# Altium schematic sheet Power.SchDoc
size A4; SheetNumber: 4; SheetTotal: 4
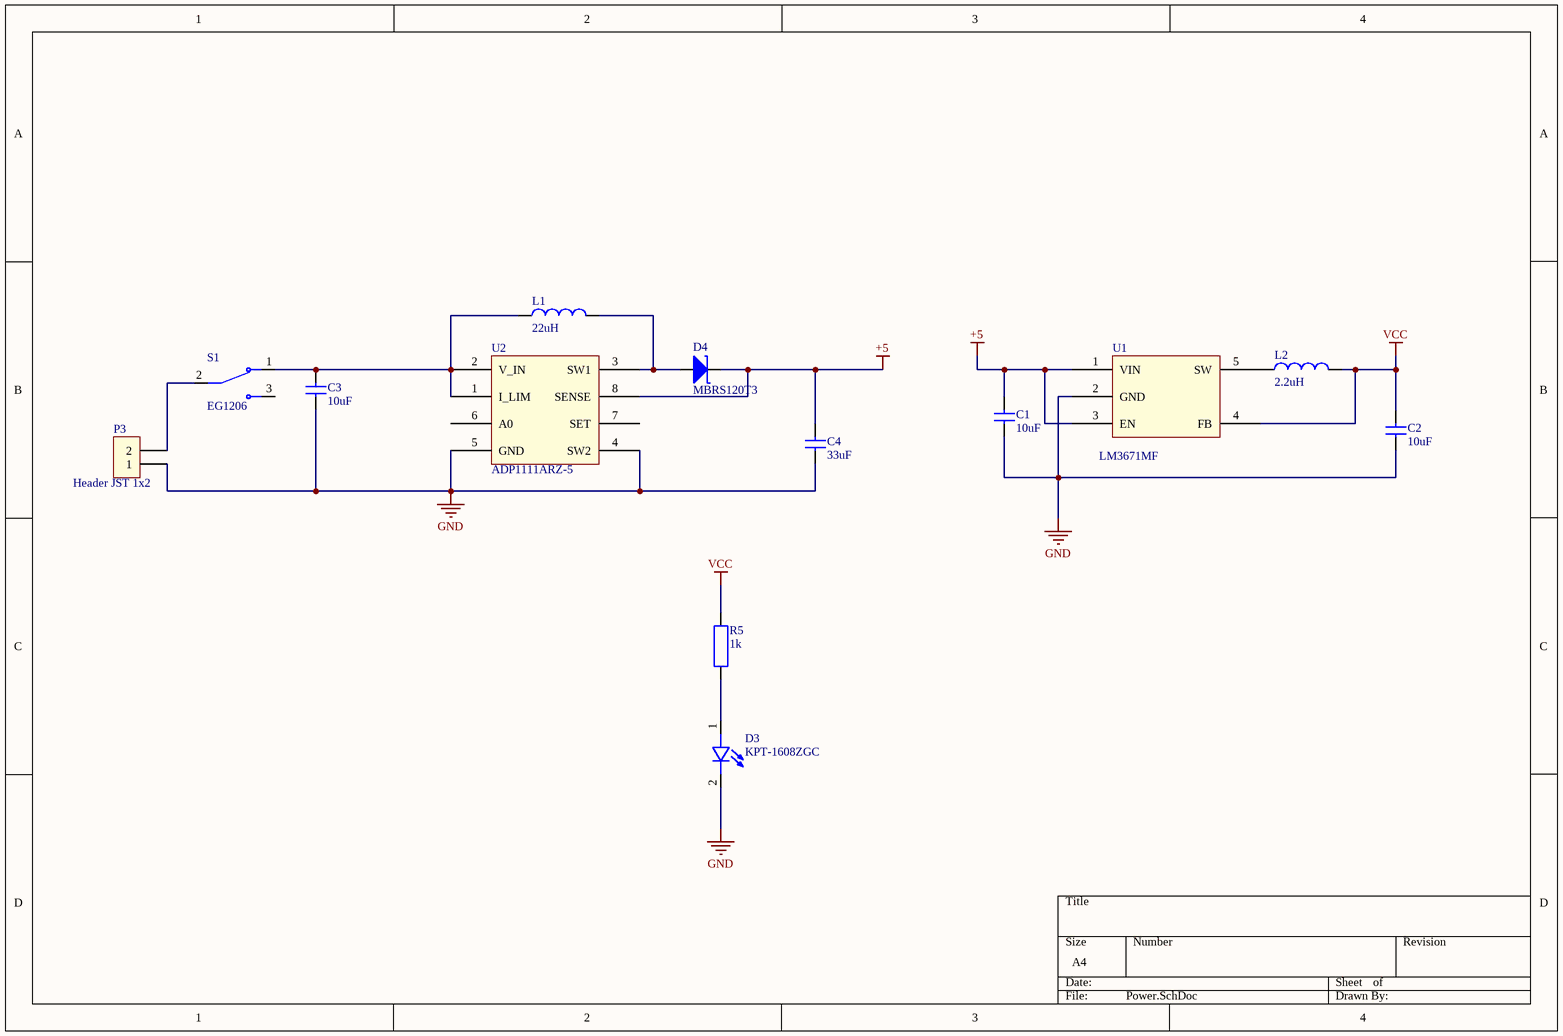
[diagram p0: Power.SchDoc]

## Parts
C1  10uF  [SMD_CAPACITOR_1206]
C2  10uF  [SMD_CAPACITOR_1206]
C3  value 10uF  [SMD_CAPACITOR_1206]  (hidden comment: 100nF)
C4  value 33uF  [SMD_CAPACITOR_1206]  (hidden comment: 100nF)
D3  KPT-1608ZGC  [LED_KPT-1608ZGC]
D4  MBRS120T3  [SMD_DO-214AC]
L1  22uH  [SMD_INDUCTOR_7.3MM]
L2  value 2.2uH  [SMD_INDUCTOR_0805]  (hidden comment: 22uH)
P3  Header JST 1x2  [THT_HEADER_78MIL_JST_1X2_MALE]
R5  1k  [SMD_RESISTOR_1206]
S1  EG1206  [SW_EG1206]
U1  LM3671MF  [SMD_SOT-23-5]
U2  ADP1111ARZ-5  [SMD_SOIC-8]

## Nets
+5: C1.2 C4.2 D4.2 U1.1(VIN) U1.3(EN) U2.8(SENSE)
GND: C1.1 C2.2 C3.2 C4.1 D3.2(C) P3.1 U1.2(GND) U2.4(SW2) U2.5(GND)
VCC: C2.1 L2.2 R5.1 U1.4(FB)
NetC3_1: C3.1 L1.1 S1.1 U2.1(I_LIM) U2.2(V_IN)
NetD3_1: D3.1(A) R5.2
NetD4_1: D4.1 L1.2 U2.3(SW1)
NetL2_1: L2.1 U1.5(SW)
NetP3_2: P3.2 S1.2

Not connected (* = marked no-connect by the designer): S1 3; U2 6(A0) 7(SET)

## Library data of the parts
C1-C4 = Capacitor: 0805: http://cz.farnell.com/webapp/wcs/stores/servlet/Search?catalogId=15001&langId=420&storeId=10156&categoryId=700000005423&sort=P_PRICE&pageSize=100&beginIndex=1&showResults=true&sf=502,707&pf=1010141074,1012080068,1012245578; 1206: http://cz.farnell.com/webapp/wcs/stores/servlet/Search?catalogId=15001&langId=420&storeId=10156&categoryId=700000005423&sort=P_PRICE&pageSize=100&beginIndex=1&showResults=true&sf=502,707&pf=1012245584
  C1 C2: Value: 10uF
D3 = KPT-1608ZGC: 1.6x0.8mm Smd Chip Led Lamp; MF: Kingbright; Value: *; SnapEDA_Link: https://www.snapeda.com/parts/KPT-1608ZGC/Kingbright/view-part/?ref=snap; Availability: In Stock; Price: None; Package: 0603 Kingbright; Check_prices: https://www.snapeda.com/parts/KPT-1608ZGC/Kingbright/view-part/?ref=eda; MP: KPT-1608ZGC
D4 = Diode_Schottky: Diode Schottky; DO-214AC: http://cz.farnell.com/webapp/wcs/stores/servlet/Search?catalogId=15001&langId=420&storeId=10156&categoryId=700000043508&sort=P_PRICE&pageSize=100&showResults=true&sf=502,707&pf=1010199473; SOD-123: http://cz.farnell.com/webapp/wcs/stores/servlet/Search?catalogId=15001&langId=420&storeId=10156&categoryId=700000043508&sort=P_PRICE&pageSize=100&showResults=true&sf=502,707&pf=1010130987; Value: MBRS120T3
L1 L2 = Inductor: 0805: http://cz.farnell.com/webapp/wcs/stores/servlet/Search?catalogId=15001&langId=420&storeId=10156&categoryId=700000005466&sort=P_PRICE&pageSize=100&showResults=true&sf=502,707&pf=1012244717,1012248439; 7.3MM: http://cz.farnell.com/webapp/wcs/stores/servlet/Search?catalogId=15001&langId=420&storeId=10156&categoryId=700000005463&sort=P_PRICE&pageSize=100&showResults=true&sf=502,707&pf=1012026164,1012026165,1012026166,1012026167,1012026168,1012026169,1012026170,1012244724
  L1: Value: 22uH
P3 = Header_JST_1x2
R5 = Resistor: 1206: http://cz.farnell.com/webapp/wcs/stores/servlet/Search?catalogId=15001&langId=420&storeId=10156&categoryId=700000005450&pageSize=100&showResults=true&sf=502,707&pf=1012211755; 0805: http://cz.farnell.com/webapp/wcs/stores/servlet/Search?catalogId=15001&langId=420&storeId=10156&categoryId=700000005450&sort=P_PRICE&pageSize=100&showResults=true&sf=502,707&pf=1012211743; Value: 1k
U1 = LM3671MF: Step Down Switching Regulator, Fixed, 2.7V-5.5V Input, 3.3V and 0.6A Output; Link: http://cz.farnell.com/texas-instruments/lm36713-3-nopb/ic-step-down-dc-dc-converter-5/dp/1685767; Value: LM3671MF
U2 = ADP1111ARZ-5: Buck, Boost Switching Regulator, Fixed, 2V-30V Input, 5V and 1.5A Output; Link: http://cz.farnell.com/analog-devices/adp1111arz-5/v-reg-step-up-down-5v-smd-soic8/dp/1439044; Value: ADP1111ARZ-5
S1 = EG1206: Value: *; Package: None; Price: None; MP: EG1206; Availability: Unavailable